# EAGLE design Skramzer (EAGLE 9.6.0)
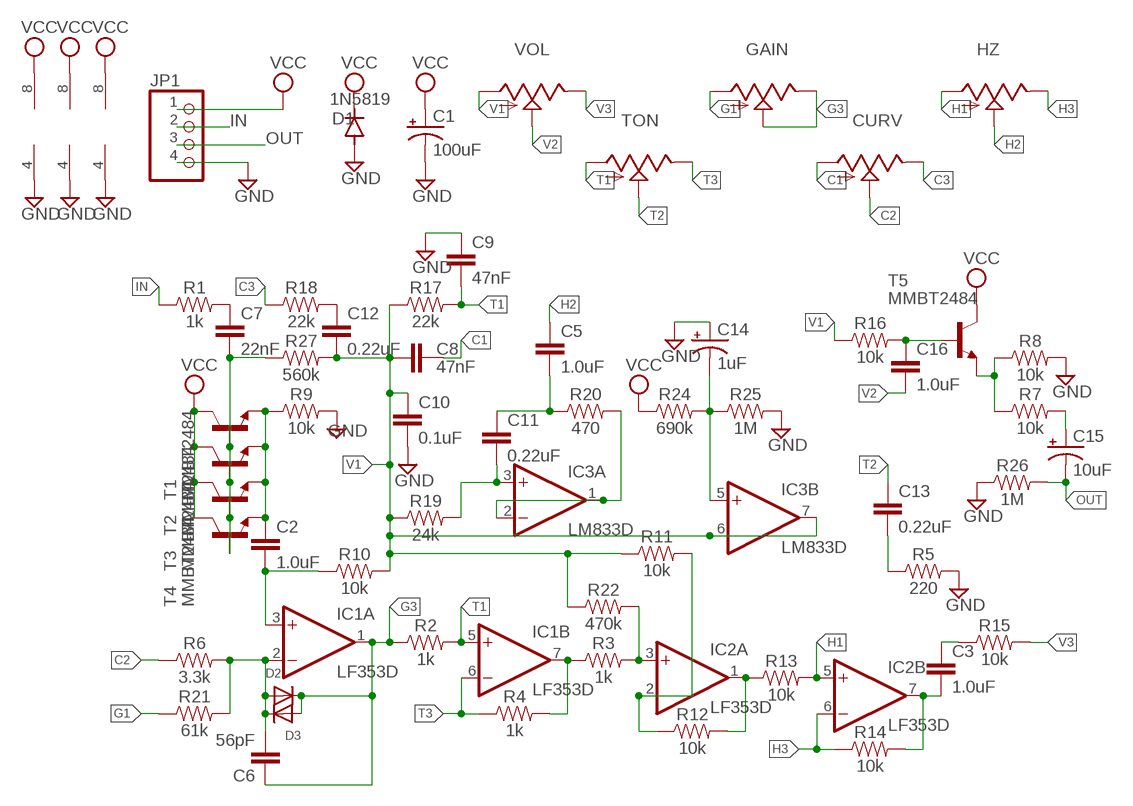
[diagram p0: schematic, sheet 1]

## Parts
C1  100uF  CAP_SMD+THRUPAN_B  [PAN_B_SMD+THRU]
C2  1.0uF  1.0UF-0603-16V-10%  [0603]
C3  1.0uF  1.0UF-0603-16V-10%  [0603]
C5  1.0uF  1.0UF-0603-16V-10%  [0603]
C6  56pF  33PF-0603-50V-5%  [0603]
C7  22nF  22NF/22,000PF-0603-50V-10%  [0603]
C8  47nF  47NF-0603-25V-5%  [0603]
C9  47nF  47NF-0603-25V-5%  [0603]
C10  0.1uF  0.1UF-0603-25V-(+80/-20%)  [0603]
C11  0.22uF  0.22UF-0603-25V-10%  [0603]
C12  0.22uF  0.22UF-0603-25V-10%  [0603]
C13  0.22uF  0.22UF-0603-25V-10%  [0603]
C14  1uF  CAP_SMD+THRUPAN_B  [PAN_B_SMD+THRU]
C15  10uF  CAP_SMD+THRUPAN_B  [PAN_B_SMD+THRU]
C16  1.0uF  1.0UF-0603-16V-10%  [0603]
CURV  9MM_SNAP-IN_POT_  [9MM_SNAP-IN_POT]
D1  1N5819  DIODE-SOD123  [SOD123]
D2  DIODESOD-123  [SOD-123]
D3  DIODESOD-123  [SOD-123]
GAIN  9MM_SNAP-IN_POT_  [9MM_SNAP-IN_POT]
HZ  9MM_SNAP-IN_POT_  [9MM_SNAP-IN_POT]
IC1  LF353D  [SO08]
IC2  LF353D  [SO08]
IC3  LM833D  [SO08]
JP1  PINHD-1X4  [1X04]
R1  1k  1KOHM-0603-1/10W-1%  [0603]
R2  1k  1KOHM-0603-1/10W-1%  [0603]
R3  1k  1KOHM-0603-1/10W-1%  [0603]
R4  1k  1KOHM-0603-1/10W-1%  [0603]
R5  220  220OHM-0603-1/10W-1%  [0603]
R6  3.3k  3.3KOHM-0603-1/10W-1%  [0603]
R7  10k  10KOHM-0603-1/10W-1%  [0603]
R8  10k  10KOHM-0603-1/10W-1%  [0603]
R9  10k  10KOHM-0603-1/10W-1%  [0603]
R10  10k  10KOHM-0603-1/10W-1%  [0603]
R11  10k  10KOHM-0603-1/10W-1%  [0603]
R12  10k  10KOHM-0603-1/10W-1%  [0603]
R13  10k  10KOHM-0603-1/10W-1%  [0603]
R14  10k  10KOHM-0603-1/10W-1%  [0603]
R15  10k  10KOHM-0603-1/10W-1%  [0603]
R16  10k  10KOHM-0603-1/10W-1%  [0603]
R17  22k  22KOHM-0603-1/10W-1%  [0603]
R18  22k  22KOHM-0603-1/10W-1%  [0603]
R19  24k  22KOHM-0603-1/10W-1%  [0603]
R20  470  470OHM-0603-1/10W-1%  [0603]
R21  61k  62KOHM-0603-1/10W-5%  [0603]
R22  470k  470OHM-0603-1/10W-1%  [0603]
R24  690k  680OHM-0603-1/10W-5%  [0603]
R25  1M  1MOHM-0603-1/4W-5%  [0603]
R26  1M  1MOHM-0603-1/4W-5%  [0603]
R27  560k  330KOHM-0603-1/10W-1%  [0603]
T1  MMBT2484  MMBT2484LT1-NPN-SOT23-BEC  [SOT23-BEC]
T2  MMBT2484  MMBT2484LT1-NPN-SOT23-BEC  [SOT23-BEC]
T3  MMBT2484  MMBT2484LT1-NPN-SOT23-BEC  [SOT23-BEC]
T4  MMBT2484  MMBT2484LT1-NPN-SOT23-BEC  [SOT23-BEC]
T5  MMBT2484  MMBT2484LT1-NPN-SOT23-BEC  [SOT23-BEC]
TON  9MM_SNAP-IN_POT_  [9MM_SNAP-IN_POT]
VOL  9MM_SNAP-IN_POT_  [9MM_SNAP-IN_POT]

## Nets
C1: C8.1 CURV.1(A)
C2: CURV.2(S) R6.1
C3: CURV.3(E) R18.1
G1: GAIN.1(A) R21.1
G3: C6.1 D2.C D3.A GAIN.2(S) GAIN.3(E) IC1.1(A:OUT) R2.1
GND: C1.- C1.--(-) C9.1 C10.2 C14.+ C14.++(+) D1.A IC1.4(P:V-) IC2.4(P:V-) IC3.4(P:V-) JP1.4 R5.2 R8.2 R9.2 R25.2 R26.1
H1: HZ.1(A) IC2.5(B:+IN) R13.2
H2: C5.1 HZ.2(S)
H3: HZ.3(E) IC2.6(B:-IN) R14.1
IN: JP1.2 R1.1
N$1: C7.2 R27.1 T1.B T2.B T3.B T4.B
N$2: C7.1 R1.2
N$3: C2.1 R9.1 T1.E T2.E T3.E T4.E
N$4: C2.2 IC1.3(A:+IN) R10.1
N$5: C14.- C14.--(-) IC3.5(B:+IN) R24.2 R25.1
N$6: C12.1 R18.2
N$7: C6.2 D2.A D3.C IC1.2(A:-IN) R6.2 R21.2
N$8: IC2.3(A:+IN) R3.2 R22.2
N$9: IC1.7(B:OUT) R3.1 R4.2
N$10: IC2.2(A:-IN) R11.2 R12.1
N$11: IC2.1(A:OUT) R12.2 R13.1
N$12: C3.1 R15.1
N$13: C3.2 IC2.7(B:OUT) R14.2
N$14: C16.1 R16.2 T5.B
N$15: C11.2 IC3.3(A:+IN) R19.2
N$16: IC3.1(A:OUT) IC3.2(A:-IN) R20.2
N$17: C5.2 C11.1 R20.1
N$18: C15.+ C15.++(+) R7.2
N$19: R7.1 R8.1 T5.E
N$21: C13.2 R5.1
OUT: C15.- C15.--(-) JP1.3 R26.2
T1: C9.2 IC1.5(B:+IN) R2.2 R17.2 TON.1(A)
T2: C13.1 TON.2(S)
T3: IC1.6(B:-IN) R4.1 TON.3(E)
V1: C8.2 C10.1 C12.2 IC3.6(B:-IN) IC3.7(B:OUT) R10.2 R11.1 R16.1 R17.1 R19.1 R22.1 R27.2 VOL.1(A)
V2: C16.2 VOL.2(S)
V3: R15.2 VOL.3(E)
VCC: C1.+ C1.++(+) D1.C IC1.8(P:V+) IC2.8(P:V+) IC3.8(P:V+) JP1.1 R24.1 T1.C T2.C T3.C T4.C T5.C

## Library data of the parts
C1 C14 C15 = MusicThingModular:CAP_SMD+THRU
C2 C3 C5 C16 = SparkFun-Capacitors:1.0UF: 1µF ceramic capacitors A capacitor is a passive two-terminal electrical component used to store electrical energy temporarily in an electric field.; PROD_ID: CAP-00868
C6 = SparkFun-Capacitors:33PF: 33pF ceramic capacitors A capacitor is a passive two-terminal electrical component used to store electrical energy temporarily in an electric field.; PROD_ID: CAP-10142; VALUE: 33pF
C7 = SparkFun-Capacitors:22NF/22,000PF: 0.022uF/22nF/22,000pF ceramic capacitors A capacitor is a passive two-terminal electrical component used to store electrical energy temporarily in an electric field.; PROD_ID: CAP-07885
C8 C9 = SparkFun-Capacitors:47NF: 47nF ceramic capacitors A capacitor is a passive two-terminal electrical component used to store electrical energy temporarily in an electric field.; PROD_ID: CAP-08605
C10 = SparkFun-Capacitors:0.1UF: 0.1µF ceramic capacitors A capacitor is a passive two-terminal electrical component used to store electrical energy temporarily in an electric field.; PROD_ID: CAP-00810
C11-C13 = SparkFun-Capacitors:0.22UF: 0.22µF ceramic capacitors A capacitor is a passive two-terminal electrical component used to store electrical energy temporarily in an electric field.; PROD_ID: CAP-07822
CURV GAIN HZ TON VOL = MusicThingModular:9MM_SNAP-IN_POT: 9mm vertical snap-in pot, Alpha / Panasonic style
D1 = diode:DIODE-: DIODE
D2 D3 = adafruit:DIODE: Diode SMADIODE - SMA Surface Mount Package 20V 1A Schottky Diode Digikey: 641-1014-6-ND DO-1N4148 - Through Hole Small Current Diode SOD-123 20V 1 A (.5mV Vf) Schottky Diode - Digikey: MBRX120TPMSCT-ND SOD-323 10V 570mA (.38mV Vf, 3ns) Schottky Diode - Digikey: ZLLS410CT-ND SOD-523 30V 30mA Schottky Diode (RB751S-40TE61) - Digikey: RB751S-40TE61CT-ND SOT23-R/W - SOT23 Package (R = Solder Paste/Reflow Ovens, W = Hand-Soldering) BAT54Film 40V 300mA - Digikey: 497-7162-1-ND
IC1 IC2 = linear:LF353: OP AMP
IC3 = linear:LM833: OP AMP
JP1 = Connector:PINHD-1X4: PIN HEADER; CATEGORY: CONNECTOR; SUB-CATEGORY: PIN-HEADER
R1-R4 = SparkFun-Resistors:1KOHM: 1kΩ resistor A resistor is a passive two-terminal electrical component that implements electrical resistance as a circuit element. Resistors act to reduce current flow, and, at the same time, act to lower voltage levels within circuits. - Wikipedia; PROD_ID: RES-07856
R5 = SparkFun-Resistors:220OHM: 220Ω resistor A resistor is a passive two-terminal electrical component that implements electrical resistance as a circuit element. Resistors act to reduce current flow, and, at the same time, act to lower voltage levels within circuits. - Wikipedia; PROD_ID: RES-07861
R6 = SparkFun-Resistors:3.3KOHM: 3.3kΩ resistor A resistor is a passive two-terminal electrical component that implements electrical resistance as a circuit element. Resistors act to reduce current flow, and, at the same time, act to lower voltage levels within circuits. - Wikipedia; PROD_ID: RES-07851
R7-R16 = SparkFun-Resistors:10KOHM: 10kΩ resistor A resistor is a passive two-terminal electrical component that implements electrical resistance as a circuit element. Resistors act to reduce current flow, and, at the same time, act to lower voltage levels within circuits. - Wikipedia; PROD_ID: RES-00824
R17 R18 = SparkFun-Resistors:22KOHM: 22kΩ resistor A resistor is a passive two-terminal electrical component that implements electrical resistance as a circuit element. Resistors act to reduce current flow, and, at the same time, act to lower voltage levels within circuits. - Wikipedia; PROD_ID: RES-07853
R19 = SparkFun-Resistors:22KOHM: 22kΩ resistor A resistor is a passive two-terminal electrical component that implements electrical resistance as a circuit element. Resistors act to reduce current flow, and, at the same time, act to lower voltage levels within circuits. - Wikipedia; PROD_ID: RES-07853; VALUE: 22k
R20 = SparkFun-Resistors:470OHM: 470Ω resistor A resistor is a passive two-terminal electrical component that implements electrical resistance as a circuit element. Resistors act to reduce current flow, and, at the same time, act to lower voltage levels within circuits. - Wikipedia; PROD_ID: RES-07869
R21 = SparkFun-Resistors:62KOHM: 62kΩ resistor A resistor is a passive two-terminal electrical component that implements electrical resistance as a circuit element. Resistors act to reduce current flow, and, at the same time, act to lower voltage levels within circuits. - Wikipedia
R22 = SparkFun-Resistors:470OHM: 470Ω resistor A resistor is a passive two-terminal electrical component that implements electrical resistance as a circuit element. Resistors act to reduce current flow, and, at the same time, act to lower voltage levels within circuits. - Wikipedia; PROD_ID: RES-07869; VALUE: 470
R24 = SparkFun-Resistors:680OHM: 680Ω resistor A resistor is a passive two-terminal electrical component that implements electrical resistance as a circuit element. Resistors act to reduce current flow, and, at the same time, act to lower voltage levels within circuits. - Wikipedia; PROD_ID: RES-09333; VALUE: 680
R25 R26 = SparkFun-Resistors:1MOHM: 1MΩ resistor A resistor is a passive two-terminal electrical component that implements electrical resistance as a circuit element. Resistors act to reduce current flow, and, at the same time, act to lower voltage levels within circuits. - Wikipedia; PROD_ID: RES-07868
R27 = SparkFun-Resistors:330KOHM: 330kΩ resistor A resistor is a passive two-terminal electrical component that implements electrical resistance as a circuit element. Resistors act to reduce current flow, and, at the same time, act to lower voltage levels within circuits. - Wikipedia; PROD_ID: RES-08968; VALUE: 330k
T1-T5 = MusicThingModular:*-NPN-: NPN Transistror BF959 corrected 2008.03.06

## Board
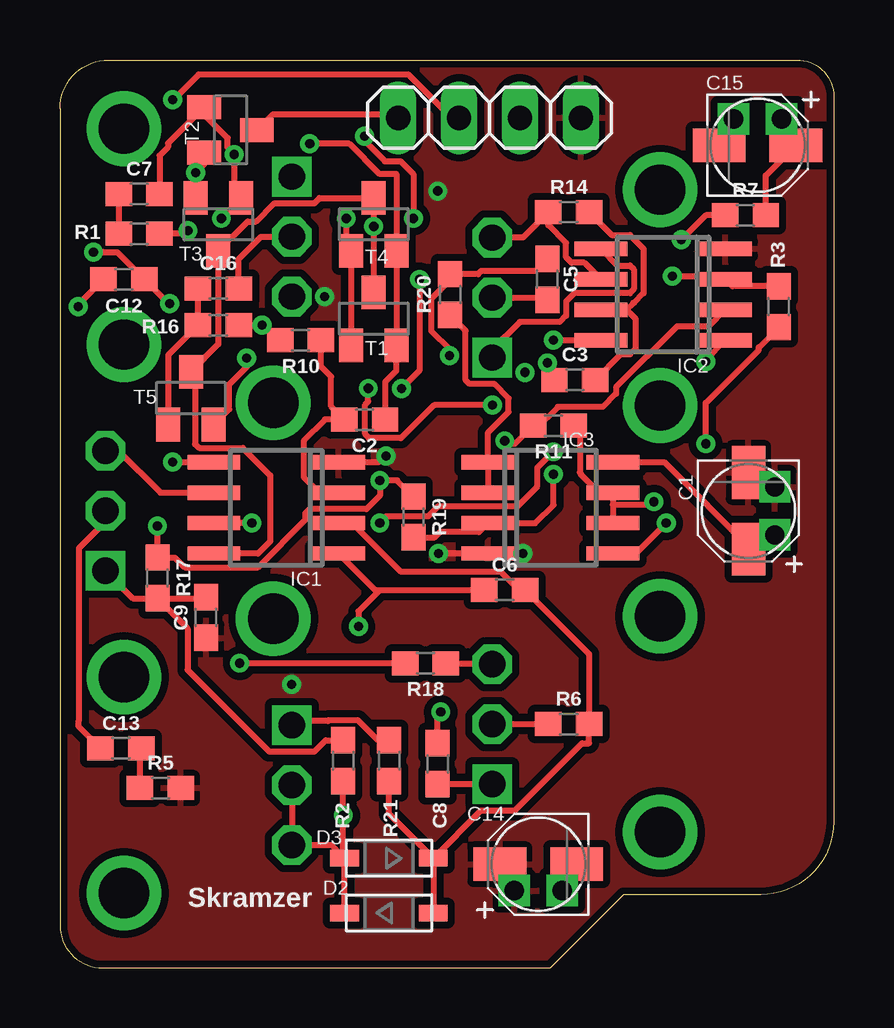
[diagram p1: board, top side]
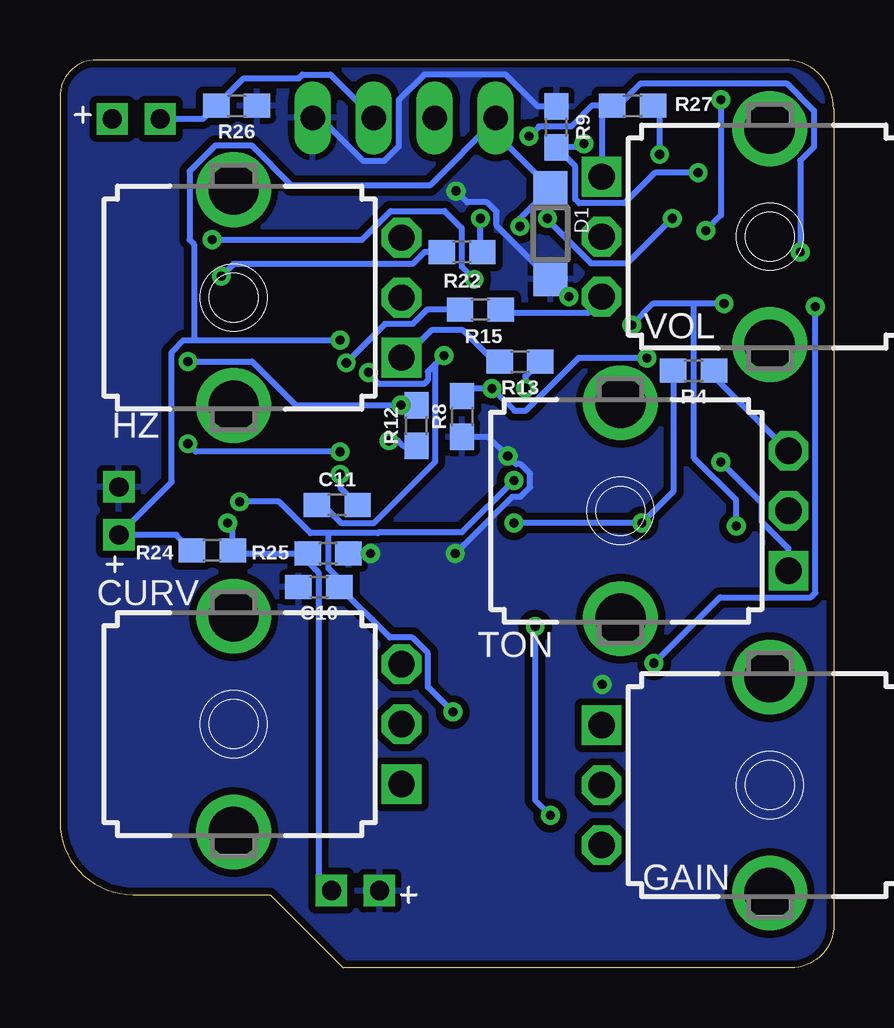
[diagram p2: board, bottom side, seen from below]

Size 32.26 x 37.85 mm. Coordinates in mm from the lower left corner, seen from the top.
Outline: 1.78,0 20.45,0 23.5,3.05 29.21,3.05 arc90 32.26,6.1 32.26,36.32 arc90 30.73,37.85 2.03,37.85 arc90 0,35.81 0,1.78 arc90 1.78,0
Copper layers (1*16): Top 0.035mm / dielectric 1.5mm / Bottom 0.035mm
Design rules "default *": minimum track width 6mil, minimum drill 0.35mm, track to track 6mil, track to pad 6mil, pad to pad 6mil, via to via 6mil, smd to smd 6mil, copper to edge 10mil, drill to drill 6mil, minimum pad ring 10mil, minimum via ring 8mil, stop-mask expansion 4mil, vias tented up to drill 0mil, thermal gap 10mil

### Footprints (pad centres in the part's own frame; a part is rotated, then mirrored left to right if it is on the bottom)
PAN_B_SMD+THRU = smd 2.2 x 1.4: + 1.6,0; - -1.6,0 | drill 0.8 pad 0.9 square: ++ 1,1.1; -- -1,1.1
0603 = smd 1.1 x 1: 1 -0.85,0; 2 0.85,0
9MM_SNAP-IN_POT = drill 1.1 square: 1 -2.5,-7 | drill 1.1 octagon: 2 0,-7; 3 2.5,-7 | drill 2.1 pad 2.794: CHASSIS1 -4.5,0; CHASSIS2 4.5,0
SOD123 = smd 1.4 x 1.4: A 1.9,0; C -1.9,0
SOD-123 = smd 1.2 x 0.7: A 1.85,0; C -1.85,0
SO08 = smd 0.6 x 2.2: 1 -1.905,-2.6; 2 -0.635,-2.6; 3 0.635,-2.6; 4 1.905,-2.6; 5 1.905,2.6; 6 0.635,2.6; 7 -0.635,2.6; 8 -1.905,2.6
1X04 = drill 1.016 long: 1 -3.81,0; 2 -1.27,0; 3 1.27,0; 4 3.81,0
SOT23-BEC = smd 1 x 1.4: B -0.95,-1.1; C 0,1.1; E 0.95,-1.1

### Placement (x,y rotation side)
C1  28.7,19.05 270 top
C2  12.7,22.86 180 top
C3  21.46,24.51 0 top
C5  20.32,28.7 90 top
C6  18.54,15.75 0 top
C7  3.3,32.26 0 top
C8  15.75,8.51 90 top
C9  6.1,14.61 90 top
C10  21.46,15.88 180 bottom
C11  20.7,19.3 0 bottom
C12  2.67,28.7 0 top
C13  2.54,9.14 0 top
C14  19.94,4.32 180 top
C15  29.08,34.29 0 top
C16  6.6,28.32 0 top
CURV  25.02,10.16 90 bottom
D1  11.81,30.61 270 bottom
D2  13.72,2.29 0 top
D3  13.72,4.57 180 top
GAIN  2.67,7.62 270 bottom
HZ  25.02,27.94 90 bottom
IC1  9.02,19.18 90 top
IC2  25.15,28.07 90 top
IC3  20.45,19.18 270 top
JP1  17.91,35.43 0 top
R1  3.3,30.61 180 top
R2  11.81,8.64 90 top
R3  29.97,27.56 90 top
R4  5.84,24.89 180 bottom
R5  4.19,7.49 0 top
R6  21.21,10.16 0 top
R7  28.57,31.37 0 top
R8  15.49,22.99 270 bottom
R9  11.56,35.05 90 bottom
R10  10.03,26.16 180 top
R11  20.57,22.61 180 top
R12  17.4,22.61 90 bottom
R13  13.08,25.27 180 bottom
R14  21.21,31.5 0 top
R15  14.73,27.43 0 bottom
R16  6.6,26.8 180 top
R17  4.06,16.26 270 top
R18  15.24,12.7 180 top
R19  14.73,18.8 270 top
R20  16.26,28.07 270 top
R21  13.72,8.64 270 top
R22  15.49,29.84 180 bottom
R24  25.91,17.4 0 bottom
R25  21.08,17.27 0 bottom
R26  24.89,35.94 180 bottom
R27  8.38,35.94 180 bottom
T1  13.08,27.05 0 top
T2  7.11,34.92 270 top
T3  6.6,30.99 180 top
T4  13.08,30.99 0 top
T5  5.46,23.75 0 top
TON  8.89,19.05 90 bottom
VOL  2.67,30.48 270 bottom

### Tracks (layer width: path | path; a pad name or v marks a point on that pad's centre or on a via)
C1
  Top 0.254: C8.1 CURV.1
C2
  Top 0.254: CURV.2 R6.1
C3
  Top 0.254: R18.1 17.98,12.7 CURV.3
G1
  Top 0.254: R21.1 13.26,9.49 12.43,10.31 11.2,10.31 11.17,10.29 9.83,10.29 GAIN.1
G3  (via drill 0.38)
  Top 0.254: GAIN.2 GAIN.3 11.32,5.12 11.81,4.63 | D2.C D3.A 11.81,4.63 | 11.81,4.63 v11.81,6.35 R2.1 | IC1.1 13.14,15.75 13.34,15.75 | 13.34,15.75 C6.1 | 13.34,15.75 12.45,14.86 v12.45,14.22
  Bottom 0.254: v12.45,14.22 12.45,6.99 v11.81,6.35
GND  (via drill 0.38)
  Top 0.254: C14.++ 18.94,3.72 C14.+ | IC1.4 13.27,21.08 13.52,21.34 v13.59,21.34 | v19.3,17.27 IC3.4 v15.78,17.27
  Bottom 0.254: R8.2 14.39,22.14 v13.59,21.34 13.25,20.99 13.06,20.99 12.66,20.6 12.66,20.04 13.06,19.65 13.4,19.65 v15.78,17.27 | R25.2 v19.3,17.27 | v11.04,27.98 11.08,27.98 D1.A 11.83,28.71 14.06,30.94 14.06,31.52 14.45,31.91 15.28,31.91 v15.75,32.38 | R9.2 12.33,35.9 13.67,37.24 17.07,37.24 18.14,36.17 18.14,34.24 18.75,33.63 19.61,33.63 21.41,35.43 JP1.4
  other vias: 9.65,11.81
  pour Top (isolate 0.305): -0.64,37.59 -0.64,-0.64 32.89,-0.64 32.89,38.1 -0.13,38.1
  pour Bottom (isolate 0.305): -0.51,37.97 -0.51,3.94 -0.51,-0.64 32.89,-0.64 32.89,38.1 -0.38,38.1
H1
  Top 0.254: IC2.5 23.24,29.28 23.76,29.28 23.93,29.12 23.93,28.29 23.76,28.12 21.44,28.12 21.1,27.78 21.1,27.19 20.84,26.92 19.18,26.92 18.02,25.77 HZ.1
  Bottom 0.254: R13.2 14.15,25.27 15.46,26.58 16.77,26.58 17.91,25.44 HZ.1
H2
  Top 0.254: HZ.2 20.23,27.94 C5.1
H3
  Top 0.254: IC2.6 21.86,29.39 21.33,29.39 21.1,29.62 21.1,30.22 20.36,30.96 R14.1 19.3,30.44 HZ.3
IN  (via drill 0.38)
  Top 0.254: JP1.2 16.33,35.43 14.53,37.24 5.78,37.24 4.74,36.2 v4.7,36.2 | v5.33,30.73 5.21,30.61 R1.1
  Bottom 0.254: v4.7,36.2 4.7,31.37 v5.33,30.73
N$1  (via drill 0.38)
  Top 0.254: C7.2 4.15,33.87 4.5,34.22 4.5,34.37 T2.B 6.01,35.57 6.99,34.59 6.99,34.17 v7.26,33.91 7.26,32.38 T3.B 7.55,32.06 v6.73,31.24 | T1.B T4.B 11.94,30.08 v11.94,31.24
  Bottom 0.254: R27.1 7.26,35.67 v7.26,33.91 | v11.94,31.24 11.94,31.19 10.12,29.38 8.6,29.38 v6.73,31.24
N$2
  Top 0.254: C7.1 R1.2
N$3  (via drill 0.38)
  Top 0.254: T3.E v5.65,33.15 6.01,33.51 T2.E | v10.41,34.35 12.07,34.35 13.33,33.09 14.03,33.09 T4.E T1.E 14.03,24.89 13.57,24.43 13.57,22.88 C2.1
  Bottom 0.254: v5.65,33.15 7.46,33.15 8.73,31.88 10.61,31.88 10.77,32.04 10.77,33.42 R9.1 10.56,34.2 v10.41,34.35
N$4
  Top 0.254: IC1.3 10.79,19.81 10.16,20.45 10.16,21.97 11.05,22.86 C2.2 11.3,23.41 11.3,24.64 10.88,25.06 R10.1
N$5  (via drill 0.38)
  Top 0.254: C14.-- 21.54,3.82 C14.- | v25.27,18.54 24,17.27 IC3.5
  Bottom 0.254: v25.27,18.54 25.06,18.33 R24.2 24.93,17.27 23.5,17.27 R25.1 21.93,16.94 21.48,16.49 21.48,3.76 C14.--
N$6  (via drill 0.38)
  Top 0.254: R18.2 v7.49,12.7 | v0.76,27.56 0.76,27.65 C12.1
  Bottom 0.254: v7.49,12.7 4.75,15.45 0.95,15.45 0.76,15.63 v0.76,27.56
N$7
  Top 0.254: D3.C D2.A | D3.C 13.72,6.42 R21.2 | IC1.2 12.18,18.54 14.19,16.53 18.36,16.53 19.14,15.75 C6.2 22.06,13.08 R6.2 22.06,9.36 21.76,9.36 18.96,6.56 17.55,6.56 D3.C
N$8  (via drill 0.38)
  Top 0.254: v25.53,28.83 27.62,28.83 IC2.3 28.04,28.41 R3.2
  Bottom 0.254: R22.2 17.05,29.84 17.56,29.34 25.02,29.34 v25.53,28.83
N$9  (via drill 0.38)
  Top 0.254: v8,18.54 IC1.7 | v20.57,21.51 20.31,21.25 20.3,21.25 19.9,20.85 19.9,20.07 19.06,19.23 15.76,19.23 15.35,18.82 13.61,18.82 v13.34,18.54 | R3.1 29.12,25.86 29.12,25.75 26.92,23.55 v26.92,21.84
  Bottom 0.254: R4.2 6.69,19.85 v8,18.54 v13.34,18.54 | v20.57,21.51 26.59,21.51 v26.92,21.84
N$10  (via drill 0.38)
  Top 0.254: R11.2 19.6,22.48 | 19.6,22.48 18.96,21.84 18.67,21.84 v18.54,21.97 | IC2.2 27.05,26.74 25.72,26.74 23.18,24.2 23.18,23.93 22.63,23.39 20.76,23.39 19.85,22.48 19.6,22.48
  Bottom 0.254: v18.54,21.97 18.16,21.97 17.95,21.76 R12.1
N$11  (via drill 0.38)
  Top 0.254: IC2.1 26.92,25.34 v26.92,25.27 | v18.03,23.46 15.59,23.46 14.22,22.08 12.88,22.08 12.72,22.24 12.72,23.48 12.85,23.61 v12.85,24.16
  Bottom 0.254: v26.92,25.27 v26.92,25.28 24.26,25.28 22.44,23.46 v18.03,23.46 R12.2 | R13.1 12.85,24.65 v12.85,24.16
N$12  (via drill 0.38)
  Top 0.254: v20.32,25.22 20.61,24.93 C3.1
  Bottom 0.254: R15.1 16.96,27.43 17.56,26.84 18.71,26.84 v20.32,25.22
N$13
  Top 0.254: C3.2 23.39,25.58 23.76,25.58 24,25.82 24,27.05 23.62,27.43 | 23.62,27.43 IC2.7 | R14.2 23,30.55 23.76,30.55 24.33,29.98 24.33,28.12 23.93,27.72 23.91,27.72 23.62,27.43
N$14
  Top 0.254: C16.1 R16.2 4.51,25.55 T5.B
N$15  (via drill 0.38)
  Top 0.254: R19.2 15.62,17.95 15.84,18.16 17.47,18.16 IC3.3 19.81,18.54 20.57,19.3 v20.57,20.57
  Bottom 0.254: v20.57,20.57 20.57,20.03 C11.2
N$16
  Top 0.254: IC3.2 IC3.1 17.85,22.32 18.71,23.18 18.71,23.73 18.11,24.34 17.08,24.34 16.91,24.5 16.91,26.56 R20.2
N$17  (via drill 0.38)
  Top 0.254: C5.2 19.81,29.04 17.56,29.04 17.43,28.92 R20.1 16.26,28.66 15.48,27.88 15.48,26.55 16.24,25.79 v16.24,25.53
  Bottom 0.254: C11.1 21.3,19.3 20.52,18.52 19.18,18.52 16.62,21.09 16.62,25.15 v16.24,25.53 16.91,24.85 16.91,24.5 17.08,24.34 18.96,24.34 19.12,24.5 19.12,24.56 v19.39,24.82
N$18
  Top 0.254: R7.2 29.43,33.03 C15.+ 30.68,34.79 C15.++
N$19  (via drill 0.38)
  Top 0.254: T5.E 7.05,23.29 7.05,24.31 7.79,25.05 v7.79,25.42 | R7.1 26.92,31.37 v25.91,30.35 | v14.99,28.7 14.99,24.89 v14.25,24.15
  Bottom 0.254: v7.79,25.42 10.63,25.42 12.84,23.22 13.32,23.22 v14.25,24.15 15.18,24.15 R8.1 | v25.91,30.35 19.67,30.35 18.48,31.54 16.22,31.54 15.52,30.84 15.52,29.23 v14.99,28.7
N$21
  Top 0.254: R5.1 3.34,9.1 C13.2
OUT
  Top 0.254: C15.-- 28.08,34.89 C15.-
  Bottom 0.254: C15.-- 26.29,35.39 R26.2 24.6,37.08 22.3,37.08 22.15,37.24 20.98,37.24 JP1.3
T1  (via drill 0.38)
  Top 0.254: TON.1 3.03,15.41 R17.2 | R17.2 6.05,15.41 C9.2 | R17.2 5.32,14.15 5.32,12.43 8.73,9.02 10.61,9.02 11.08,9.49 R2.2 | v4.7,21.08 IC1.5
  Bottom 0.254: v4.7,21.08 2.99,19.38 2.99,18.59 1.89,17.49 TON.1
T2
  Top 0.254: TON.2 1.89,18.59 0.79,17.49 0.79,10.31 0.76,10.29 0.76,10.07 C13.1
T3
  Top 0.254: TON.3 2.45,21.55 4.19,19.81 IC1.6
  Bottom 0.254: TON.3 4.99,24.65 R4.1
V1  (via drill 0.38)
  Top 0.254: R11.1 21.67,22.36 21.67,20.67 21.72,20.62 21.72,20.57 22.48,19.81 IC3.7 23.05,19.3 | 23.05,19.3 IC3.6 | R16.1 v8.42,26.8 8.55,26.8 R10.2 | v4.57,27.69 4.53,27.69 C12.2 2.39,29.83 1.79,29.83 1.77,29.84 v1.39,29.84 | v4.06,18.41 R17.1 4.79,17.11 5.2,16.69 8.25,16.69 10.24,18.68 10.24,18.96 10.4,19.12 12.77,19.12 13.34,19.68 v13.34,20.32 14.06,20.32 R19.1 | v12.7,34.67 12.68,34.7 12.68,34.49 13.55,33.62 14.2,33.62 14.73,33.09 v14.73,31.24 | v24.77,19.43 24.64,19.3 23.05,19.3 | C8.2 15.75,10.54 v15.88,10.67
  Bottom 0.254: R27.2 9.67,35.51 VOL.1 | v4.57,27.69 5.84,27.69 | 5.84,27.69 7.53,27.69 v8.42,26.8 | v4.06,18.41 4.06,19.5 5.82,21.25 5.82,27.66 5.84,27.69 | R22.1 14.73,29.93 14.73,30.63 v14.73,31.24 | R27.2 10.07,35.94 10.94,35.07 12.3,35.07 v12.7,34.67 | v13.34,20.32 15.49,18.16 18.97,18.16 19.02,18.12 21.08,18.12 | 21.08,18.12 21.81,18.12 23.12,19.43 v24.77,19.43 | 21.08,18.12 21.06,18.1 21.06,16.66 20.61,16.21 C10.1 18.5,13.76 17.56,13.76 16.91,13.12 16.91,11.71 v15.88,10.67 | R27.2 8.98,35.94 8.05,36.87 1.96,36.87 0.83,35.74 0.83,34.22 1.39,33.65 v1.39,29.84
V2
  Top 0.254: C16.2 7.45,29.55 8.38,30.48 VOL.2
V3
  Bottom 0.254: R15.2 13.76,27.3 10.21,27.3 9.67,27.85 VOL.3
VCC  (via drill 0.38)
  Top 0.254: T1.C v13.08,30.91 T4.C 10.82,32.09 10.61,31.88 8.94,31.88 8.17,31.11 7.83,31.11 T3.C 6.6,25.99 T5.C 5.63,24.68 5.63,21.83 5.79,21.67 7.62,21.67 8.76,20.53 8.76,17.78 8.26,17.27 IC1.8 | T2.C 8.85,35.56 13.97,35.56 JP1.1 | C1.++ 29.2,17.45 28.83,17.45 | 28.83,17.45 C1.+ | IC3.8 25.2,21.08 28.83,17.45 | v20.57,26.16 IC2.8
  Bottom 0.254: R24.1 27.41,18.05 C1.++ 27.6,20.25 27.6,25.68 27.11,26.16 26.67,26.16 | 26.67,26.16 v20.57,26.16 | v13.08,30.91 13.08,31.24 D1.C 14.1,34.79 JP1.1 14.1,35.36 16.84,32.61 22.59,32.61 24.26,34.28 25.78,34.28 26.86,33.2 26.86,30.35 26.67,30.16 26.67,26.16

### Text on the board
tPlace: Skramzer